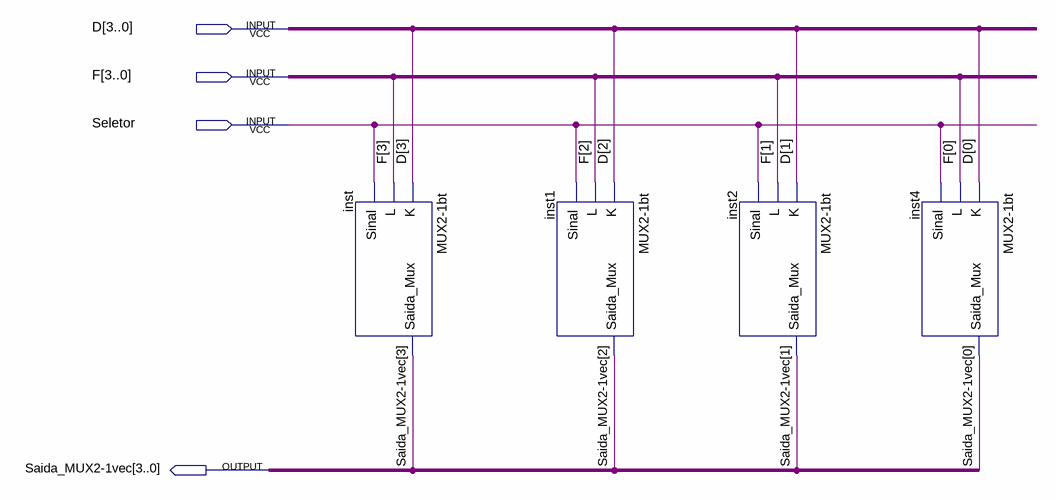
[diagram p0: schematic sheet]
// Quartus schematic MUX2-1vec.bdf as structural Verilog: 4 symbols, 4 pins
module \MUX2-1vec  (
  input  [3:0] D,
  input  [3:0] F,
  input  Seletor,
  output [3:0] \Saida_MUX2-1vec 
);

  \MUX2-1bt  inst (.K(D[3]), .L(F[3]), .Sinal(Seletor), .Saida_Mux(\Saida_MUX2-1vec [3]));
  \MUX2-1bt  inst1 (.K(D[2]), .L(F[2]), .Sinal(Seletor), .Saida_Mux(\Saida_MUX2-1vec [2]));
  \MUX2-1bt  inst2 (.K(D[1]), .L(F[1]), .Sinal(Seletor), .Saida_Mux(\Saida_MUX2-1vec [1]));
  \MUX2-1bt  inst4 (.K(D[0]), .L(F[0]), .Sinal(Seletor), .Saida_Mux(\Saida_MUX2-1vec [0]));
endmodule
